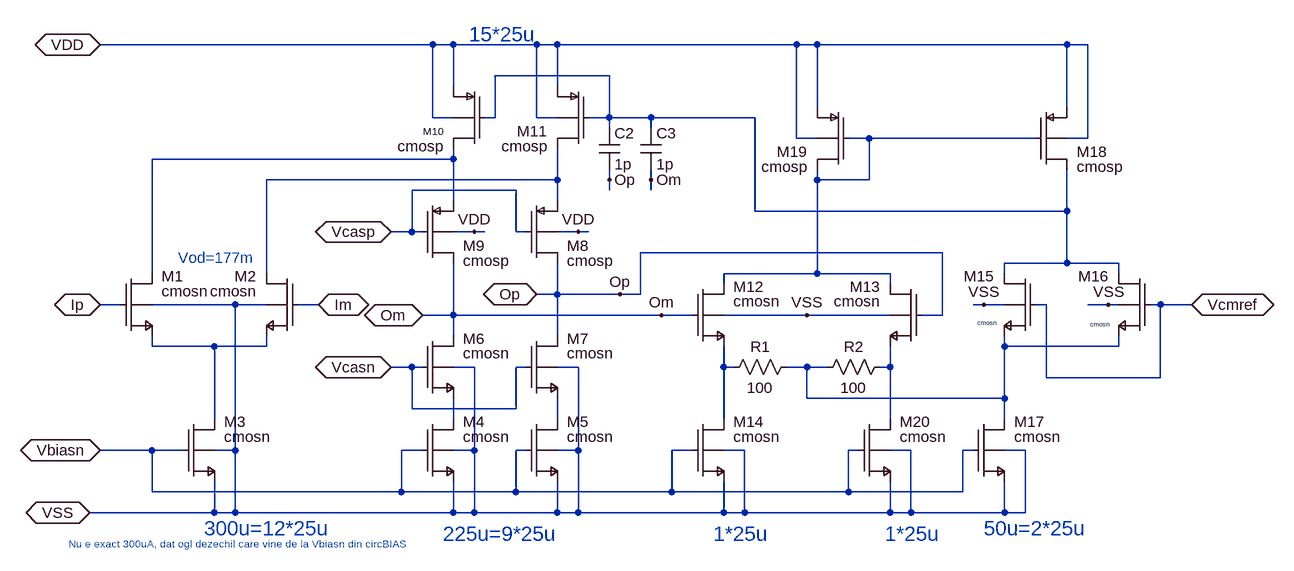
[diagram p0: schematic opampFC.asc]
opampFC.asc, the LTspice schematic file:
Version 4
SHEET 1 1072 680
WIRE -464 -224 -976 -224
WIRE -432 -224 -464 -224
WIRE -304 -224 -432 -224
WIRE -272 -224 -304 -224
WIRE 96 -224 -272 -224
WIRE 128 -224 96 -224
WIRE 512 -224 128 -224
WIRE 544 -224 512 -224
WIRE -192 -176 -368 -176
WIRE -432 -160 -432 -224
WIRE -272 -160 -272 -224
WIRE 128 -128 128 -224
WIRE 512 -128 512 -224
WIRE -464 -112 -464 -224
WIRE -432 -112 -464 -112
WIRE -368 -112 -368 -176
WIRE -368 -112 -384 -112
WIRE -304 -112 -304 -224
WIRE -272 -112 -304 -112
WIRE -192 -112 -192 -176
WIRE -192 -112 -224 -112
WIRE -128 -112 -192 -112
WIRE 32 -112 -128 -112
WIRE -192 -96 -192 -112
WIRE -128 -96 -128 -112
WIRE 96 -80 96 -224
WIRE 128 -80 96 -80
WIRE 208 -80 176 -80
WIRE 464 -80 208 -80
WIRE 544 -80 544 -224
WIRE 544 -80 512 -80
WIRE -432 -48 -432 -64
WIRE -432 -48 -896 -48
WIRE -272 -16 -272 -64
WIRE -272 -16 -720 -16
WIRE -192 -16 -192 -32
WIRE -128 -16 -128 -32
WIRE 128 -16 128 -32
WIRE 208 -16 208 -80
WIRE 208 -16 128 -16
WIRE -336 0 -496 0
WIRE -192 0 -192 -16
WIRE -128 0 -128 -16
WIRE -432 16 -432 -48
WIRE -272 16 -272 -16
WIRE 32 32 32 -112
WIRE 512 32 512 -32
WIRE 512 32 32 32
WIRE -496 64 -496 0
WIRE -496 64 -528 64
WIRE -480 64 -496 64
WIRE -400 64 -432 64
WIRE -384 64 -400 64
WIRE -336 64 -336 0
WIRE -320 64 -336 64
WIRE -240 64 -272 64
WIRE -224 64 -240 64
WIRE 320 96 -144 96
WIRE 512 112 512 32
WIRE 512 112 416 112
WIRE 592 112 512 112
WIRE -896 128 -896 -48
WIRE -720 128 -720 -16
WIRE 128 128 128 -16
WIRE 128 128 -16 128
WIRE 240 128 128 128
WIRE 416 128 416 112
WIRE 592 128 592 112
WIRE -16 144 -16 128
WIRE 240 144 240 128
WIRE -272 160 -272 112
WIRE -272 160 -304 160
WIRE -176 160 -272 160
WIRE -144 160 -144 96
WIRE -144 160 -176 160
WIRE -944 176 -976 176
WIRE -768 176 -896 176
WIRE -720 176 -768 176
WIRE -640 176 -672 176
WIRE 384 176 368 176
WIRE 416 176 384 176
WIRE 480 176 464 176
WIRE 576 176 544 176
WIRE 592 176 576 176
WIRE 656 176 640 176
WIRE 704 176 656 176
WIRE -432 192 -432 112
WIRE -432 192 -480 192
WIRE -112 192 -432 192
WIRE -64 192 -112 192
WIRE 112 192 -16 192
WIRE 240 192 112 192
WIRE 320 192 320 96
WIRE 320 192 288 192
WIRE -432 224 -432 192
WIRE -272 224 -272 160
WIRE -896 240 -896 224
WIRE -800 240 -896 240
WIRE -720 240 -720 224
WIRE -720 240 -800 240
WIRE 416 240 416 224
WIRE 592 240 592 224
WIRE 592 240 416 240
WIRE -496 272 -528 272
WIRE -480 272 -496 272
WIRE -400 272 -432 272
WIRE -320 272 -336 272
WIRE -240 272 -272 272
WIRE -16 272 -16 240
WIRE 0 272 -16 272
WIRE 112 272 80 272
WIRE 144 272 112 272
WIRE 240 272 240 240
WIRE 240 272 224 272
WIRE 480 288 480 176
WIRE 656 288 656 176
WIRE 656 288 480 288
WIRE 112 320 112 272
WIRE 416 320 416 240
WIRE 416 320 112 320
WIRE -496 336 -496 272
WIRE -336 336 -336 272
WIRE -336 336 -496 336
WIRE -800 352 -800 240
WIRE -432 352 -432 320
WIRE -272 352 -272 320
WIRE -16 352 -16 272
WIRE 240 352 240 272
WIRE 416 352 416 320
WIRE -896 400 -976 400
WIRE -848 400 -896 400
WIRE -768 400 -768 176
WIRE -768 400 -800 400
WIRE -480 400 -512 400
WIRE -400 400 -400 272
WIRE -400 400 -432 400
WIRE -320 400 -336 400
WIRE -240 400 -240 272
WIRE -240 400 -272 400
WIRE -64 400 -96 400
WIRE 16 400 -16 400
WIRE 192 400 176 400
WIRE 272 400 240 400
WIRE 368 400 352 400
WIRE 448 400 416 400
WIRE -896 464 -896 400
WIRE -512 464 -512 400
WIRE -512 464 -896 464
WIRE -336 464 -336 400
WIRE -336 464 -512 464
WIRE -96 464 -96 400
WIRE -96 464 -336 464
WIRE 176 464 176 400
WIRE 176 464 -96 464
WIRE 352 464 352 400
WIRE 352 464 176 464
WIRE -800 496 -800 448
WIRE -800 496 -992 496
WIRE -768 496 -768 400
WIRE -768 496 -800 496
WIRE -432 496 -432 448
WIRE -432 496 -768 496
WIRE -400 496 -400 400
WIRE -400 496 -432 496
WIRE -272 496 -272 448
WIRE -272 496 -400 496
WIRE -240 496 -240 400
WIRE -240 496 -272 496
WIRE -16 496 -16 448
WIRE -16 496 -240 496
WIRE 16 496 16 400
WIRE 16 496 -16 496
WIRE 240 496 240 448
WIRE 240 496 16 496
WIRE 272 496 272 400
WIRE 272 496 240 496
WIRE 416 496 416 448
WIRE 416 496 272 496
WIRE 448 496 448 400
WIRE 448 496 416 496
FLAG -976 -224 VDD
IOPIN -976 -224 BiDir
FLAG -992 496 VSS
IOPIN -992 496 BiDir
FLAG -976 400 Vbiasn
IOPIN -976 400 BiDir
FLAG -528 272 Vcasn
IOPIN -528 272 BiDir
FLAG -528 64 Vcasp
IOPIN -528 64 BiDir
FLAG -640 176 Im
IOPIN -640 176 BiDir
FLAG -976 176 Ip
IOPIN -976 176 BiDir
FLAG -400 64 VDD
FLAG -240 64 VDD
FLAG 112 192 VSS
FLAG 704 176 Vcmref
IOPIN 704 176 BiDir
FLAG 384 176 VSS
FLAG -176 160 Op
FLAG -112 192 Om
FLAG -192 -16 Op
FLAG -128 -16 Om
FLAG -304 160 Op
IOPIN -304 160 BiDir
FLAG -480 192 Om
IOPIN -480 192 BiDir
FLAG 576 176 VSS
SYMBOL nmosb -944 128 R0
WINDOW 0 63 4 Left 2
SYMATTR InstName M1
SYMATTR Value cmosn
SYMATTR Value2 l=1u w=5.1u ad=1.02p as=1.02p pd=10.6u ps=10.6u m=5
SYMBOL nmosb -672 128 M0
WINDOW 0 63 4 Left 2
SYMATTR InstName M2
SYMATTR Value cmosn
SYMATTR Value2 l=1u w=5.1u ad=1.02p as=1.02p pd=10.6u ps=10.6u m=5
SYMBOL nmosb -848 352 R0
WINDOW 0 63 4 Left 2
SYMATTR InstName M3
SYMATTR Value cmosn
SYMATTR Value2 l=1u w=2.7u ad=0.54p as=0.54p pd=5.8u ps=5.8u m=12
SYMBOL nmosb -480 352 R0
WINDOW 0 63 4 Left 2
SYMATTR InstName M4
SYMATTR Value cmosn
SYMATTR Value2 l=1u w=2.7u ad=0.54p as=0.54p pd=5.8u ps=5.8u m=9
SYMBOL nmosb -320 352 R0
WINDOW 0 63 4 Left 2
SYMATTR InstName M5
SYMATTR Value cmosn
SYMATTR Value2 l=1u w=2.7u ad=0.54p as=0.54p pd=5.8u ps=5.8u m=9
SYMBOL nmosb -480 224 R0
WINDOW 0 63 4 Left 2
SYMATTR InstName M6
SYMATTR Value cmosn
SYMATTR Value2 l=1u w=2.7u ad=0.54p as=0.54p pd=5.8u ps=5.8u m=9
SYMBOL nmosb -320 224 R0
WINDOW 0 63 4 Left 2
SYMATTR InstName M7
SYMATTR Value cmosn
SYMATTR Value2 l=1u w=2.7u ad=0.54p as=0.54p pd=5.8u ps=5.8u m=9
SYMBOL pmosb -320 16 R0
WINDOW 0 63 69 Left 2
SYMATTR InstName M8
SYMATTR Value cmosp
SYMATTR Value2 l=1u w=14u ad=2.8p as=2.8p pd=28.4u ps=28.4u m=9
SYMBOL pmosb -480 16 R0
WINDOW 0 63 69 Left 2
SYMATTR InstName M9
SYMATTR Value cmosp
SYMATTR Value2 l=1u w=14u ad=2.8p as=2.8p pd=28.4u ps=28.4u m=9
SYMBOL pmosb -384 -160 M0
WINDOW 0 63 69 Left 1
SYMATTR InstName M10
SYMATTR Value cmosp
SYMATTR Value2 l=1u w=14u ad=2.8p as=2.8p pd=28.4u ps=28.4u m=15
SYMBOL pmosb -224 -160 M0
WINDOW 0 63 69 Left 2
SYMATTR InstName M11
SYMATTR Value cmosp
SYMATTR Value2 l=1u w=14u ad=2.8p as=2.8p pd=28.4u ps=28.4u m=15
SYMBOL nmosb -64 144 R0
WINDOW 0 63 4 Left 2
SYMATTR InstName M12
SYMATTR Value cmosn
SYMATTR Value2 l=1u w=2.7u ad=0.54p as=0.54p pd=5.8u ps=5.8u m=1
SYMBOL nmosb 288 144 M0
WINDOW 0 63 4 Left 2
SYMATTR InstName M13
SYMATTR Value cmosn
SYMATTR Value2 l=1u w=2.7u ad=0.54p as=0.54p pd=5.8u ps=5.8u m=1
SYMBOL nmosb -64 352 R0
WINDOW 0 63 4 Left 2
SYMATTR InstName M14
SYMATTR Value cmosn
SYMATTR Value2 l=1u w=2.7u ad=0.54p as=0.54p pd=5.8u ps=5.8u m=1
SYMBOL res 96 256 R90
WINDOW 0 0 56 VBottom 2
WINDOW 3 32 56 VTop 2
SYMATTR InstName R1
SYMATTR Value 100
SYMBOL res 240 256 R90
WINDOW 0 0 56 VBottom 2
WINDOW 3 32 56 VTop 2
SYMATTR InstName R2
SYMATTR Value 100
SYMBOL nmosb 464 128 M0
WINDOW 3 60 76 Left 0
WINDOW 0 63 4 Left 2
SYMATTR Value cmosn
SYMATTR InstName M15
SYMATTR Value2 l=1u w=2.7u ad=0.54p as=0.54p pd=5.8u ps=5.8u m=1
SYMBOL nmosb 640 128 M0
WINDOW 3 62 78 Left 0
WINDOW 0 63 4 Left 2
SYMATTR Value cmosn
SYMATTR InstName M16
SYMATTR Value2 l=1u w=2.7u ad=0.54p as=0.54p pd=5.8u ps=5.8u m=1
SYMBOL nmosb 368 352 R0
WINDOW 0 63 4 Left 2
SYMATTR InstName M17
SYMATTR Value cmosn
SYMATTR Value2 l=1u w=2.7u ad=0.54p as=0.54p pd=5.8u ps=5.8u m=2
SYMBOL pmosb 464 -128 R0
WINDOW 0 63 69 Left 2
SYMATTR InstName M18
SYMATTR Value cmosp
SYMATTR Value2 l=1u w=14u ad=2.8p as=2.8p pd=28.4u ps=28.4u m=2
SYMBOL pmosb 176 -128 M0
WINDOW 0 63 69 Left 2
SYMATTR InstName M19
SYMATTR Value cmosp
SYMATTR Value2 l=1u w=14u ad=2.8p as=2.8p pd=28.4u ps=28.4u m=2
SYMBOL nmosb 192 352 R0
WINDOW 0 63 4 Left 2
SYMATTR InstName M20
SYMATTR Value cmosn
SYMATTR Value2 l=1u w=2.7u ad=0.54p as=0.54p pd=5.8u ps=5.8u m=1
SYMBOL cap -208 -96 R0
SYMATTR InstName C2
SYMATTR Value 1p
SYMBOL cap -144 -96 R0
SYMATTR InstName C3
SYMATTR Value 1p
TEXT -448 528 Left 3 ;225u=9*25u
TEXT -32 528 Left 3 ;1*25u
TEXT 232 528 Left 3 ;1*25u
TEXT 384 520 Left 3 ;50u=2*25u
TEXT -816 520 Left 3 ;300u=12*25u
TEXT -856 104 Left 2 ;Vod=177m
TEXT -1024 544 Left 1 ;Nu e exact 300uA, dat ogl dezechil care vine de la Vbiasn din circBIAS
TEXT -408 -240 Left 3 ;15*25u

The netlist it stands for:
* opampFC.asc
M1 N003 Ip N005 VSS cmosn l=1u w=5.1u ad=1.02p as=1.02p pd=10.6u ps=10.6u m=5
M2 N004 Im N005 VSS cmosn l=1u w=5.1u ad=1.02p as=1.02p pd=10.6u ps=10.6u m=5
M3 N005 Vbiasn VSS VSS cmosn l=1u w=2.7u ad=0.54p as=0.54p pd=5.8u ps=5.8u m=12
M4 N009 Vbiasn VSS VSS cmosn l=1u w=2.7u ad=0.54p as=0.54p pd=5.8u ps=5.8u m=9
M5 N010 Vbiasn VSS VSS cmosn l=1u w=2.7u ad=0.54p as=0.54p pd=5.8u ps=5.8u m=9
M6 Om Vcasn N009 VSS cmosn l=1u w=2.7u ad=0.54p as=0.54p pd=5.8u ps=5.8u m=9
M7 Op Vcasn N010 VSS cmosn l=1u w=2.7u ad=0.54p as=0.54p pd=5.8u ps=5.8u m=9
M8 Op Vcasp N004 VDD cmosp l=1u w=14u ad=2.8p as=2.8p pd=28.4u ps=28.4u m=9
M9 Om Vcasp N003 VDD cmosp l=1u w=14u ad=2.8p as=2.8p pd=28.4u ps=28.4u m=9
M10 N003 N001 VDD VDD cmosp l=1u w=14u ad=2.8p as=2.8p pd=28.4u ps=28.4u m=15
M11 N004 N001 VDD VDD cmosp l=1u w=14u ad=2.8p as=2.8p pd=28.4u ps=28.4u m=15
M12 N002 Om N007 VSS cmosn l=1u w=2.7u ad=0.54p as=0.54p pd=5.8u ps=5.8u m=1
M13 N002 Op N008 VSS cmosn l=1u w=2.7u ad=0.54p as=0.54p pd=5.8u ps=5.8u m=1
M14 N007 Vbiasn VSS VSS cmosn l=1u w=2.7u ad=0.54p as=0.54p pd=5.8u ps=5.8u m=1
R1 N006 N007 100
R2 N008 N006 100
M15 N001 Vcmref N006 VSS cmosn l=1u w=2.7u ad=0.54p as=0.54p pd=5.8u ps=5.8u m=1
M16 N001 Vcmref N006 VSS cmosn l=1u w=2.7u ad=0.54p as=0.54p pd=5.8u ps=5.8u m=1
M17 N006 Vbiasn VSS VSS cmosn l=1u w=2.7u ad=0.54p as=0.54p pd=5.8u ps=5.8u m=2
M18 N001 N002 VDD VDD cmosp l=1u w=14u ad=2.8p as=2.8p pd=28.4u ps=28.4u m=2
M19 N002 N002 VDD VDD cmosp l=1u w=14u ad=2.8p as=2.8p pd=28.4u ps=28.4u m=2
M20 N008 Vbiasn VSS VSS cmosn l=1u w=2.7u ad=0.54p as=0.54p pd=5.8u ps=5.8u m=1
C2 N001 Op 1p
C3 N001 Om 1p
.model NMOS NMOS
.model PMOS PMOS
.lib standard.mos
* 225u=9*25u
* 1*25u
* 1*25u
* 50u=2*25u
* 300u=12*25u
* Vod=177m
* Nu e exact 300uA, dat ogl dezechil care vine de la Vbiasn din circBIAS
* 15*25u
.backanno
.end